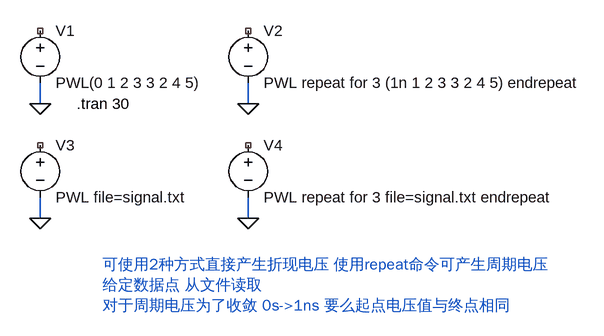
[diagram p0: schematic Draft5.asc]
Draft5.asc, the LTspice schematic file:
Version 4.1
SHEET 1 1020 680
WIRE 96 192 96 160
WIRE 416 192 416 160
WIRE 96 368 96 336
WIRE 416 368 416 336
FLAG 96 192 0
FLAG 416 192 0
FLAG 96 368 0
FLAG 416 368 0
SYMBOL voltage 96 64 R0
WINDOW 123 0 0 Left 0
WINDOW 39 0 0 Left 0
SYMATTR InstName V1
SYMATTR Value PWL(0 1 2 3 3 2 4 5)
SYMBOL voltage 416 64 R0
WINDOW 123 0 0 Left 0
WINDOW 39 0 0 Left 0
SYMATTR InstName V2
SYMATTR Value PWL repeat for 3 (1n 1 2 3 3 2 4 5) endrepeat
SYMBOL voltage 96 240 R0
WINDOW 123 0 0 Left 0
WINDOW 39 0 0 Left 0
SYMATTR InstName V3
SYMATTR Value PWL file=signal.txt
SYMBOL voltage 416 240 R0
WINDOW 123 0 0 Left 0
WINDOW 39 0 0 Left 0
SYMATTR InstName V4
SYMATTR Value PWL repeat for 3 file=signal.txt endrepeat
TEXT 152 192 Left 2 !.tran 30
TEXT 192 440 Left 2 ;可使用2种方式直接产生折现电压 使用repeat命令可产生周期电压\n给定数据点 从文件读取 \n对于周期电压为了收敛 0s->1ns 要么起点电压值与终点相同

The netlist it stands for:
* Draft5.asc
V1 NC_01 0 PWL(0 1 2 3 3 2 4 5)
V2 NC_02 0 PWL repeat for 3 (1n 1 2 3 3 2 4 5) endrepeat
V3 NC_03 0 PWL file=signal.txt
V4 NC_04 0 PWL repeat for 3 file=signal.txt endrepeat
.tran 30
* 可使用2种方式直接产生折现电压 使用repeat命令可产生周期电压
* 给定数据点 从文件读取
* 对于周期电压为了收敛 0s->1ns 要么起点电压值与终点相同
.backanno
.end